# EasyEDA schematic Layout_Design.json
TITLE: Sheet_4; REV: 1.0; Date: 2023-10-29; Sheet: 1/1; Drawn By: ashraf_342; Company: Your Company
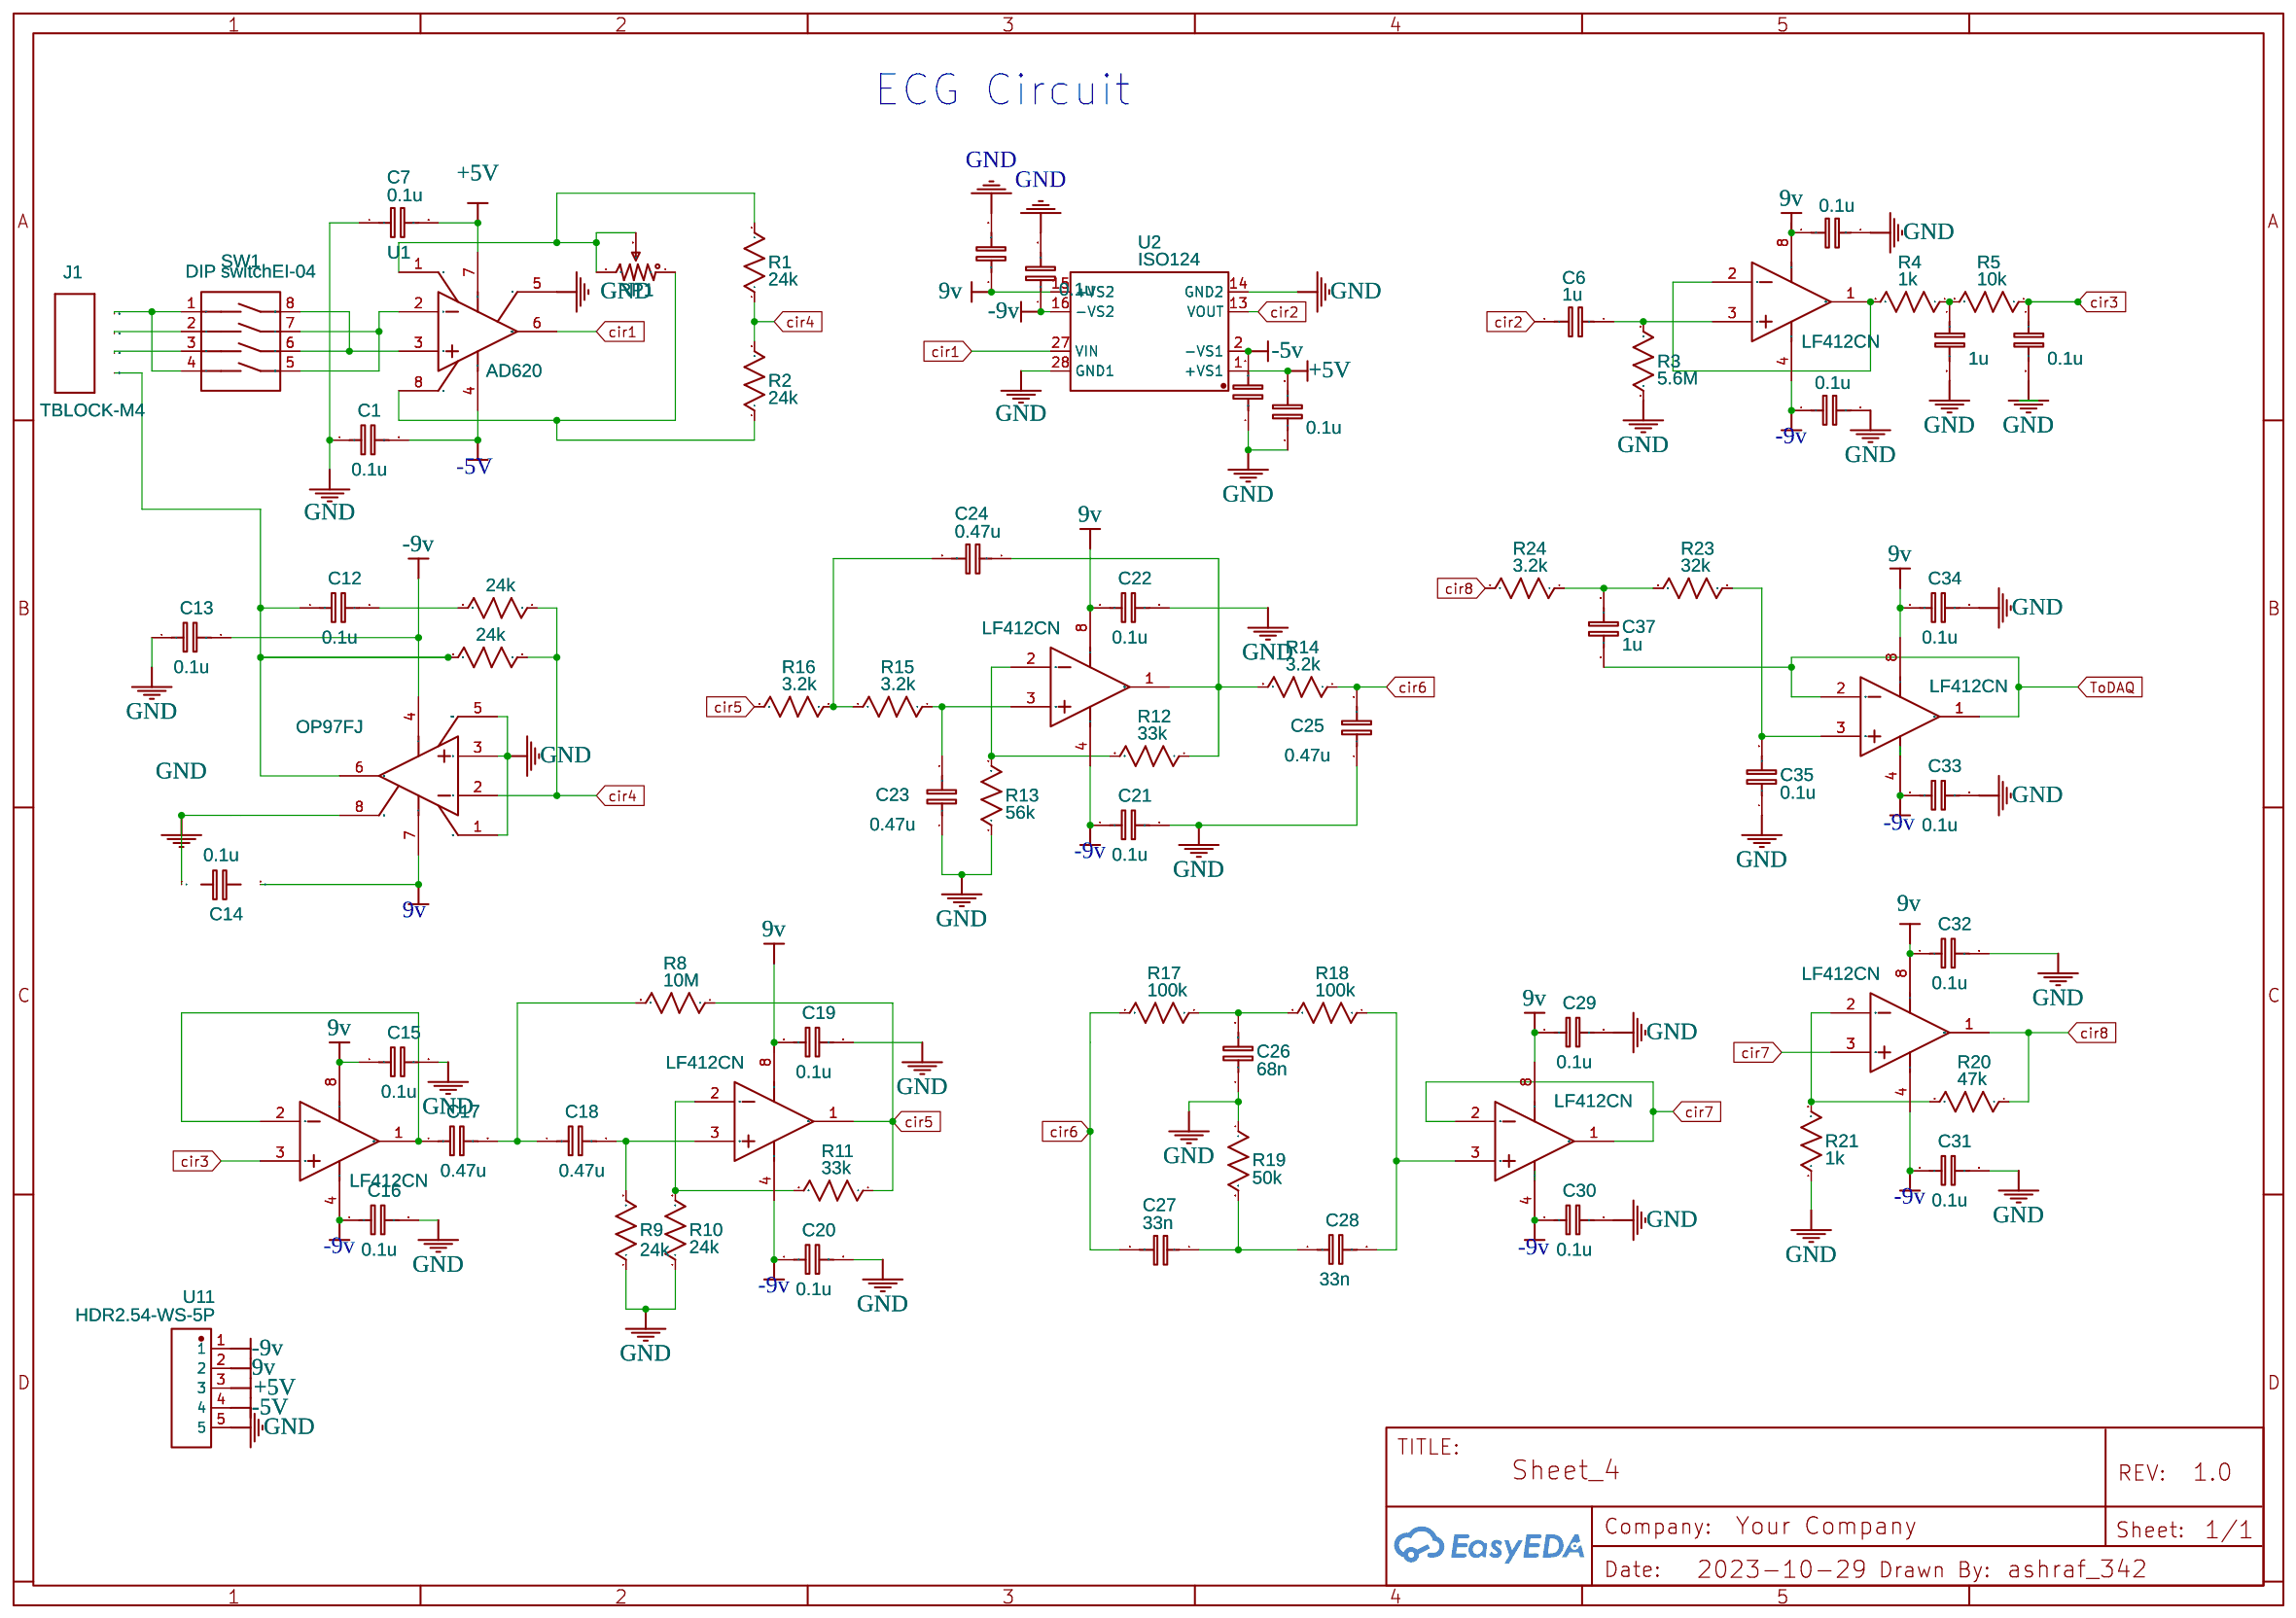
[diagram p0: schematic sheet]

## Parts
C1  0.1u  [C0603]
C2  0.1u  [C0603]
C3  0.1u  [C0603]
C4  0.1u  [C0603]
C5  0.1u  [C0603]
C6  1u  [C0603]
C7  0.1u  [C0603]
C8  0.1u  [C0603]
C9  1u  [C0603]
C10  0.1u  [C0603]
C11  0.1u  [C0603]
C12  0.1u  [C0603]
C13  0.1u  [C0603]
C14  0.1u  [C0603]
C15  0.1u  [C0603]
C16  0.1u  [C0603]
C17  0.47u  [C0603]
C18  0.47u  [C0603]
C19  0.1u  [C0603]
C20  0.1u  [C0603]
C21  0.1u  [C0603]
C22  0.1u  [C0603]
C23  0.47u  [C0603]
C24  0.47u  [C0603]
C25  0.47u  [C0603]
C26  68n  [C0603]
C27  33n  [C0603]
C28  33n  [C0603]
C29  0.1u  [C0603]
C30  0.1u  [C0603]
C31  0.1u  [C0603]
C32  0.1u  [C0603]
C33  0.1u  [C0603]
C34  0.1u  [C0603]
C35  0.1u  [C0603]
C37  1u  [C0603]
J1  TBLOCK-M4  [TBLOCK-M4]
R1  24k  [R0603]
R2  24k  [R0603]
R3  5.6M  [R0603]
R4  1k  [R0603]
R5  10k  [R0603]
R6  24k  [R0603]
R7  24k  [R0603]
R8  10M  [R0603]
R9  24k  [R0603]
R10  24k  [R0603]
R11  33k  [R0603]
R12  33k  [R0603]
R13  56k  [R0603]
R14  3.2k  [R0603]
R15  3.2k  [R0603]
R16  3.2k  [R0603]
R17  100k  [R0603]
R18  100k  [R0603]
R19  50k  [R0603]
R20  47k  [R0603]
R21  1k  [R0603]
R23  32k  [R0603]
R24  3.2k  [R0603]
RP1  R_3386P_US  [RES-ADJ-TH_3386P]
SW1  DIP switchEI-04  [SW-TH_DIPSWITCHEI-04]
U1  AD620  [SOIC-8_L4.9-W3.9-P1.27-LS6.0-BL]
U2  ISO124  [SOIC-28_8P-L18.1-W7.6-P1.27-LS10.7-BL-ISO124U-1K]
U3  LF412CN  [PDIP-8_L9.6-W6.4-P2.54-LS7.6-BL]  (section 1)
U4  OP97FJ  [TO-99-8_TI_LMC]
U5  LF412CN  [PDIP-8_L9.6-W6.4-P2.54-LS7.6-BL]  (section 1)
U6  LF412CN  [PDIP-8_L9.6-W6.4-P2.54-LS7.6-BL]  (section 1)
U7  LF412CN  [PDIP-8_L9.6-W6.4-P2.54-LS7.6-BL]  (section 1)
U8  LF412CN  [PDIP-8_L9.6-W6.4-P2.54-LS7.6-BL]  (section 1)
U9  LF412CN  [PDIP-8_L9.6-W6.4-P2.54-LS7.6-BL]  (section 1)
U10  LF412CN  [PDIP-8_L9.6-W6.4-P2.54-LS7.6-BL]  (section 1)
U11  HDR2.54-WS-5P  [HDR-SMD_5P-P2.54_HDR2.54-WS]

## Library data of the parts
C1-C35 C37 = C_0603_EU: Contributor: LCEDA_Lib
J1 = TBLOCK-M4: Contributor: amit_9in87
R1-R21 R23 R24 = R_0603_US: Contributor: LCEDA_Lib
RP1 = R_3386P_US: Supplier: LCSC; Contributor: LCEDA_Lib; value(Ω): 10K
SW1 = DIP switchEI-04: Supplier: LCSC; Manufacturer: 圜达; Manufacturer Part: 拨码开关EI-04; Supplier Part: C99987; JLCPCB Part Class: Extended Part; link: https://lcsc.com/eda_search?q=C99987&%26type=1&ref=editor
U1 = AD620BRZ-RL: Contributor: LCSC; Supplier: LCSC; Supplier Part: C650347; Manufacturer: Analog Devices; JLCPCB Part Class: Extended Part; link: https://lcsc.com/eda_search?q=C650347&%26type=1&ref=editor
U2 = ISO124U: Contributor: LCSC; Supplier: LCSC; Supplier Part: C40796; Manufacturer: TI(德州仪器); Manufacturer Part: ISO124U/1K; JLCPCB Part Class: Extended Part; link: https://lcsc.com/eda_search?q=C40796&%26type=1&ref=editor
U3 U5-U10 = LF412CN/NOPB: subpart_no: 1; Supplier: LCSC; Supplier Part: C1346063; Manufacturer: TI(德州仪器); JLCPCB Part Class: Extended Part; link: https://lcsc.com/eda_search?q=C1346063&%26type=1&ref=editor
U4 = OP97FJ: Contributor: lcsc; Supplier: LCSC; Supplier Part: C4368430; Manufacturer: ADI(亚德诺)/LINEAR(凌特); link: https://lcsc.com/eda_search?q=C4368430&%26type=1&ref=editor
U11 = HDR2.54-WS-5P: Contributor: LCSC; Supplier: LCSC; Supplier Part: C9900005621; Manufacturer: null; JLCPCB Part Class: Extended Part; link: https://lcsc.com/eda_search?q=C9900005621&%26type=1&ref=editor

## Nets
9v: C4.1 C8.2 C14.2 C15.1 C19.1 C22.1 C29.1 C32.1 C34.1 U2.15(+VS2) U3.8(V+) U4.7(V+) U5.8(V+) U6.8(V+) U7.8(V+) U8.8(V+) U9.8(V+) U10.8(V+) U11.2
+5V: C2.2 C7.2 U1.7(+VS) U2.1(+VS1) U11.3
-5V: C1.2 U1.4(-VS) U11.4
-5v: C3.2 U2.2(-VS1)
-9v: C5.1 C11.1 C13.2 C16.1 C20.1 C21.1 C30.1 C31.1 C33.1 U2.16(-VS2) U3.4(V-) U4.4(V-) U5.4(V-) U6.4(V-) U7.4(V-) U8.4(V-) U9.4(V-) U10.4(V-) U11.1
GND: C1.1 C2.1 C3.1 C4.2 C5.2 C7.1 C8.1 C9.2 C10.2 C11.2 C13.1 C14.1 C15.2 C16.2 C19.2 C20.2 C21.2 C22.2 C23.1 C25.1 C26.1 C29.2 C30.2 C31.2 C32.2 C33.2 C34.2 C35.1 R3.1 R9.1 R10.1 R13.1 R19.1 R21.1 U1.5(REF) U2.14(GND2) U2.28(GND1) U4.1(NULL) U4.3(IN+) U4.5(OVER COMP) U4.8(NULL) U11.5
cir1: U1.6(OUTPUT) U2.27(VIN)
cir2: C6.2 U2.13(VOUT)
cir3: C10.1 R5.1 U5.3(INA+)
cir4: R1.1 R2.2 R6.1 R7.1 U4.2(IN-)
cir5: R8.1 R11.1 R16.2 U6.1(OUTA)
cir6: C25.2 C27.2 R14.1 R17.2
cir7: U8.1(OUTA) U8.2(INA-) U9.3(INA+)
cir8: R20.1 R24.2 U9.1(OUTA)
ToDAQ: C37.1 U10.1(OUTA) U10.2(INA-)
Net-(C6-1): C6.1 R3.2 U3.3(INA+)
Net-(C9-1): C9.1 R4.1 R5.2
Net-(C12-1): C12.1 J1.4(P$4) R6.2 U4.6(OUT)
Net-(C12-2): C12.2 R7.2
Net-(C17-1): C17.1 U5.1(OUTA) U5.2(INA-)
Net-(C17-2): C17.2 C18.1 R8.2
Net-(C18-2): C18.2 R9.2 U6.3(INA+)
Net-(C23-2): C23.2 R15.1 U7.3(INA+)
Net-(C24-1): C24.1 R12.1 R14.2 U7.1(OUTA)
Net-(C24-2): C24.2 R15.2 R16.1
Net-(C26-2): C26.2 R17.1 R18.2
Net-(C27-1): C27.1 C28.1 R19.2
Net-(C28-2): C28.2 R18.1 U8.3(INA+)
Net-(C35-2): C35.2 R23.1 U10.3(INA+)
Net-(C37-2): C37.2 R23.2 R24.1
Net-(J1-1): J1.1(P$1) SW1.1 SW1.4
Net-(J1-2): J1.2(P$2) SW1.2
Net-(J1-3): J1.3(P$3) SW1.3
Net-(R1-2): R1.2 RP1.2 RP1.3 U1.1(RG)
Net-(R2-1): R2.1 RP1.1 U1.8(RG)
Net-(R4-2): R4.2 U3.1(OUTA) U3.2(INA-)
Net-(R10-2): R10.2 R11.2 U6.2(INA-)
Net-(R12-2): R12.2 R13.2 U7.2(INA-)
Net-(R20-2): R20.2 R21.2 U9.2(INA-)
Net-(SW1-5): SW1.5(S4) SW1.7(S2) U1.2(IN-)
Net-(SW1-6): SW1.6(S3) SW1.8(S1) U1.3(IN+)

## Notes on the sheet
- ECG Circuit
